# EAGLE schematic M152B (EAGLE 6.6.0)
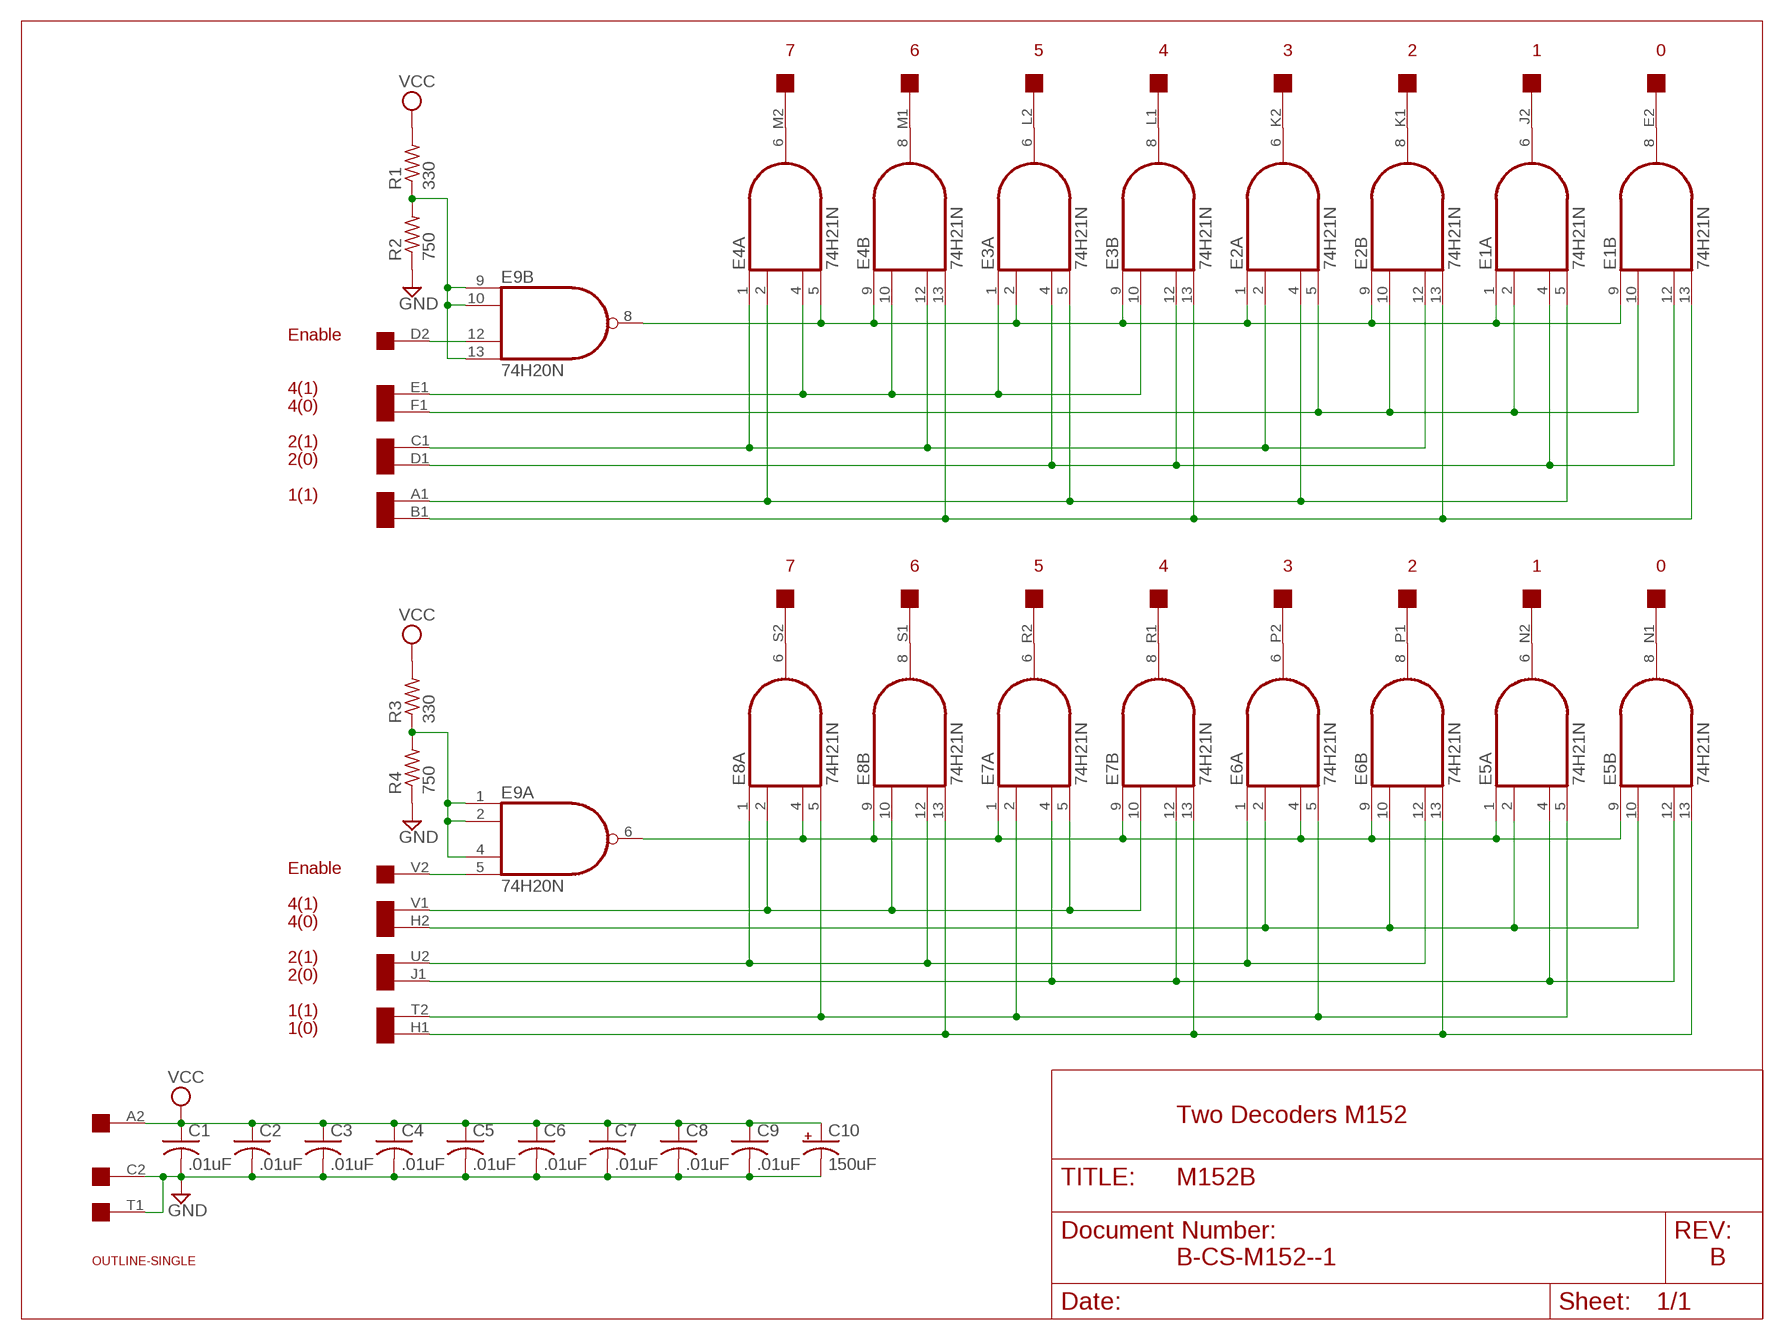
[diagram p0: schematic, sheet 1]

## Parts
C1  .01uF  C-US050-025X075  [C050-025X075]
C2  .01uF  C-US050-025X075  [C050-025X075]
C3  .01uF  C-US050-025X075  [C050-025X075]
C4  .01uF  C-US050-025X075  [C050-025X075]
C5  .01uF  C-US050-025X075  [C050-025X075]
C6  .01uF  C-US050-025X075  [C050-025X075]
C7  .01uF  C-US050-025X075  [C050-025X075]
C8  .01uF  C-US050-025X075  [C050-025X075]
C9  .01uF  C-US050-025X075  [C050-025X075]
C10  150uF  CPOL-USE25-9AXIAL  [E25-9]
E1  74H21N  74LS21N  [DIL14]
E2  74H21N  74LS21N  [DIL14]
E3  74H21N  74LS21N  [DIL14]
E4  74H21N  74LS21N  [DIL14]
E5  74H21N  74LS21N  [DIL14]
E6  74H21N  74LS21N  [DIL14]
E7  74H21N  74LS21N  [DIL14]
E8  74H21N  74LS21N  [DIL14]
E9  74H20N  7420N  [DIL14]
R1  330  R-US_0207/10  [0207/10]
R2  750  R-US_0207/10  [0207/10]
R3  330  R-US_0207/10  [0207/10]
R4  750  R-US_0207/10  [0207/10]
U$1  SINGLE  [EDGE-CON2]
U$2  OUTLINE-SINGLE  [SINGLE]

## Nets
GND [supply]: C1.2 C2.2 C3.2 C4.2 C5.2 C6.2 C7.2 C8.2 C9.2 C10.- R2.1 R4.1 U$1.C2 U$1.T1
N$1: E9.9(B:I0) E9.10(B:I1) E9.13(B:I3) R1.1 R2.2
N$2: E9.1(A:I0) E9.2(A:I1) E9.4(A:I2) R3.1 R4.2
N$3: E9.12(B:I2) U$1.D2
N$4: E9.5(A:I3) U$1.V2
N$5: E4.6(A:O) U$1.M2
N$6: E4.8(B:O) U$1.M1
N$7: E3.6(A:O) U$1.L2
N$8: E3.8(B:O) U$1.L1
N$9: E2.6(A:O) U$1.K2
N$10: E2.8(B:O) U$1.K1
N$11: E1.6(A:O) U$1.J2
N$12: E1.8(B:O) U$1.E2
N$13: E8.6(A:O) U$1.S2
N$14: E8.8(B:O) U$1.S1
N$15: E7.6(A:O) U$1.R2
N$16: E6.6(A:O) U$1.P2
N$17: E5.6(A:O) U$1.N2
N$18: E5.8(B:O) U$1.N1
N$19: E6.8(B:O) U$1.P1
N$20: E7.8(B:O) U$1.R1
N$21: E1.1(A:I0) E1.9(B:I0) E2.1(A:I0) E2.9(B:I0) E3.2(A:I1) E3.9(B:I0) E4.5(A:I3) E4.9(B:I0) E9.8(B:O)
N$22: E3.1(A:I0) E3.10(B:I1) E4.4(A:I2) E4.10(B:I1) U$1.E1
N$23: E1.2(A:I1) E1.10(B:I1) E2.5(A:I3) E2.10(B:I1) U$1.F1
N$24: E2.2(A:I1) E2.12(B:I2) E4.1(A:I0) E4.12(B:I2) U$1.C1
N$25: E1.4(A:I2) E1.12(B:I2) E3.4(A:I2) E3.12(B:I2) U$1.D1
N$26: E1.5(A:I3) E2.4(A:I2) E3.5(A:I3) E4.2(A:I1) U$1.A1
N$27: E1.13(B:I3) E2.13(B:I3) E3.13(B:I3) E4.13(B:I3) U$1.B1
N$28: E5.1(A:I0) E5.9(B:I0) E6.4(A:I2) E6.9(B:I0) E7.1(A:I0) E7.9(B:I0) E8.4(A:I2) E8.9(B:I0) E9.6(A:O)
N$29: E7.5(A:I3) E7.10(B:I1) E8.2(A:I1) E8.10(B:I1) U$1.V1
N$30: E5.2(A:I1) E5.10(B:I1) E6.2(A:I1) E6.10(B:I1) U$1.H2
N$31: E5.4(A:I2) E5.12(B:I2) E7.4(A:I2) E7.12(B:I2) U$1.J1
N$33: E5.5(A:I3) E6.5(A:I3) E7.2(A:I1) E8.5(A:I3) U$1.T2
N$34: E5.13(B:I3) E6.13(B:I3) E7.13(B:I3) E8.13(B:I3) U$1.H1
N$35: E6.1(A:I0) E6.12(B:I2) E8.1(A:I0) E8.12(B:I2) U$1.U2
VCC [supply]: C1.1 C2.1 C3.1 C4.1 C5.1 C6.1 C7.1 C8.1 C9.1 C10.+ R1.2 R3.2 U$1.A2
Unconnected: E9.3(3:NC) E9.11(11:NC) U$1.B2 U$1.F2 U$1.U1

## Notes on the sheet
- 7 | 6 | 5 | 4 | 3 | 2 | 1 | 0
- Enable
- 4(1)
- 4(0)
- 2(1)
- 2(0)
- 1(1)
- 7 | 6 | 5 | 4 | 3 | 2 | 1 | 0
- Enable
- 4(1)
- 4(0)
- 2(1)
- 2(0)
- 1(1)
- 1(0)
- Two Decoders M152
- B-CS-M152--1 | B

## Power pins joined to a net without a drawn wire
GND: E1.7(P:GND) E2.7(P:GND) E3.7(P:GND) E4.7(P:GND) E5.7(P:GND) E6.7(P:GND) E7.7(P:GND) E8.7(P:GND) E9.7(P:GND)
VCC: E1.14(P:VCC) E2.14(P:VCC) E3.14(P:VCC) E4.14(P:VCC) E5.14(P:VCC) E6.14(P:VCC) E7.14(P:VCC) E8.14(P:VCC) E9.14(P:VCC)

## Library data of the parts
C1-C9 = rcl:C-US: CAPACITOR, American symbol
C10 = rcl:CPOL-US: POLARIZED CAPACITOR, American symbol
E1-E8 = 74xx-us:74*21: Dual 4-input AND gate
E9 = dec-con:74*20: Dual 4-input NAND gate
R1-R4 = rcl:R-US_: RESISTOR, American symbol
U$1 = dec-con:SINGLE: Single-Height DEC board
U$2 = dec-con:OUTLINE-*: Board outlines for DEC boards.

## Net classes
1 supply: width 0.813 mm